# Altium schematic sheet JS7688_convert_board_v1.0.SchDoc
size A4
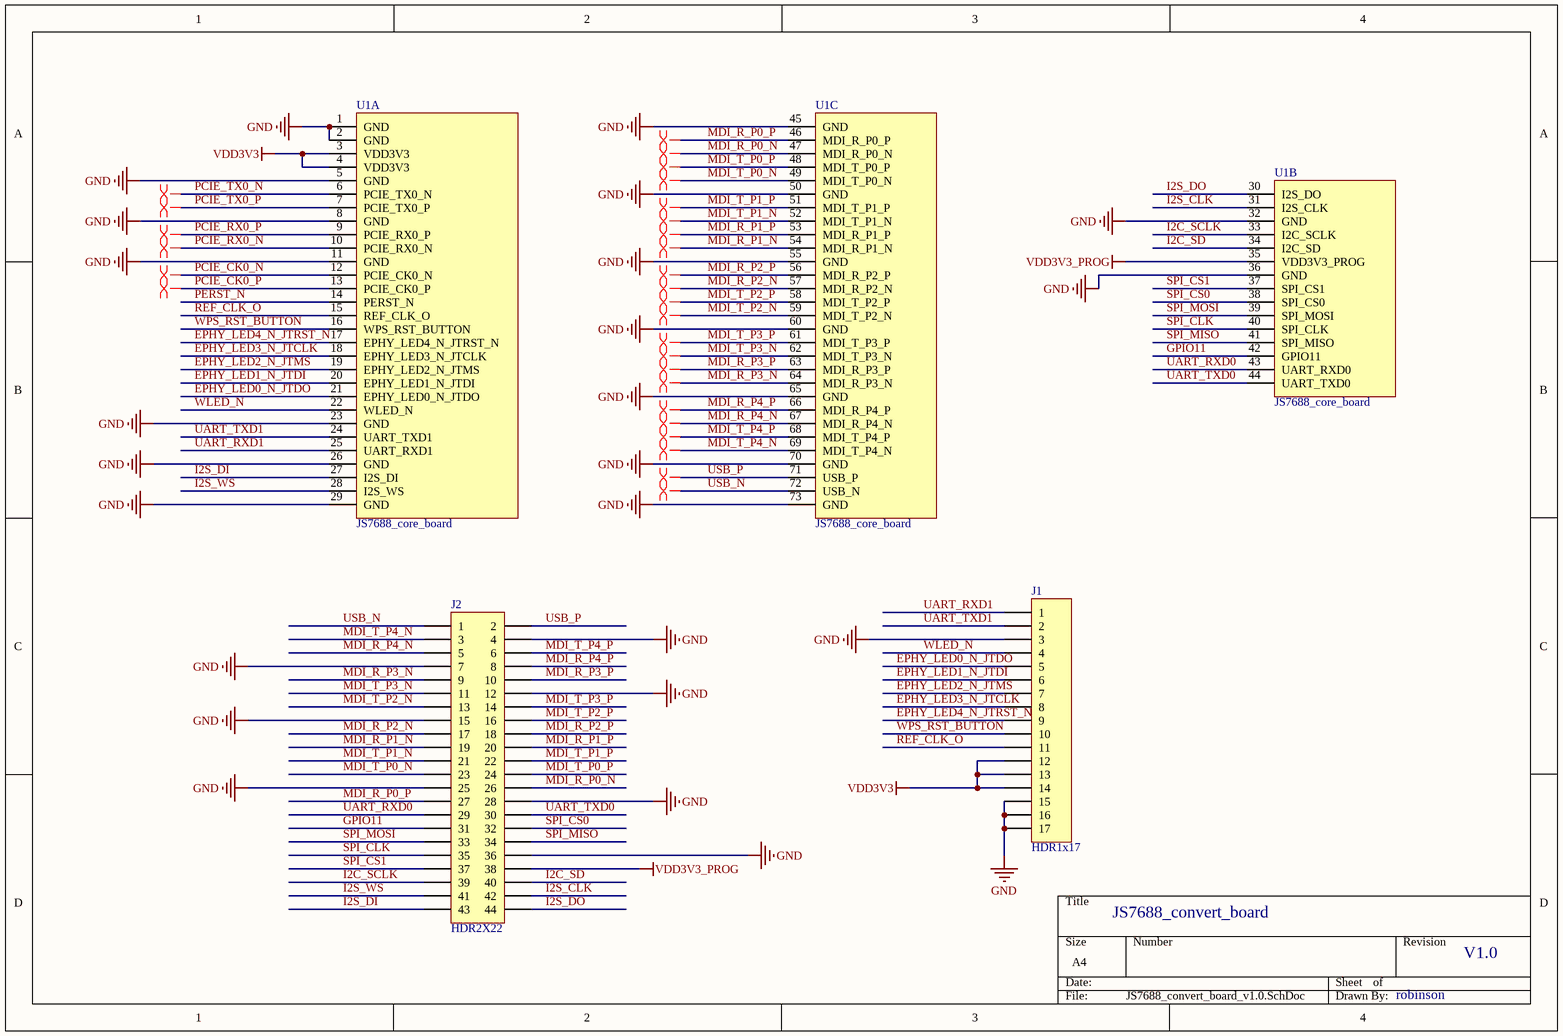
[diagram p0: JS7688_convert_board_v1.0.SchDoc]

## Parts
J1  HDR1x17  [HDR1x17-P-2.0mm]
J2  HDR2X22  [HDR2x22-P-2.0mm]
U1  JS7688_core_board  [JS7688_core_board]  (parts A,B,C of 3)

## Nets
GND: J1.3 J1.15 J1.16 J1.17 J2.4 J2.7 J2.12 J2.15 J2.25 J2.28 J2.36 U1.1(GND) U1.2(GND) U1.5(GND) U1.8(GND) U1.11(GND) U1.23(GND) U1.26(GND) U1.29(GND) U1.32(GND) U1.36(GND) U1.45(GND) U1.50(GND) U1.55(GND) U1.60(GND) U1.65(GND) U1.70(GND) U1.73(GND)
VDD3V3: J1.12 J1.13 J1.14 U1.3(VDD3V3) U1.4(VDD3V3)
VDD3V3_PROG: J2.38 U1.35(VDD3V3_PROG)
EPHY_LED0_N_JTDO: J1.5 U1.21(EPHY_LED0_N_JTDO)
EPHY_LED1_N_JTDI: J1.6 U1.20(EPHY_LED1_N_JTDI)
EPHY_LED2_N_JTMS: J1.7 U1.19(EPHY_LED2_N_JTMS)
EPHY_LED3_N_JTCLK: J1.8 U1.18(EPHY_LED3_N_JTCLK)
EPHY_LED4_N_JTRST_N: J1.9 U1.17(EPHY_LED4_N_JTRST_N)
GPIO11: J2.31 U1.42(GPIO11)
I2C_SCLK: J2.39 U1.33(I2C_SCLK)
I2C_SD: J2.40 U1.34(I2C_SD)
I2S_CLK: J2.42 U1.31(I2S_CLK)
I2S_DI: J2.43 U1.27(I2S_DI)
I2S_DO: J2.44 U1.30(I2S_DO)
I2S_WS: J2.41 U1.28(I2S_WS)
MDI_R_P0_N: J2.26 U1.47(MDI_R_P0_N)
MDI_R_P0_P: J2.27 U1.46(MDI_R_P0_P)
MDI_R_P1_N: J2.19 U1.54(MDI_R_P1_N)
MDI_R_P1_P: J2.20 U1.53(MDI_R_P1_P)
MDI_R_P2_N: J2.17 U1.57(MDI_R_P2_N)
MDI_R_P2_P: J2.18 U1.56(MDI_R_P2_P)
MDI_R_P3_N: J2.9 U1.64(MDI_R_P3_N)
MDI_R_P3_P: J2.10 U1.63(MDI_R_P3_P)
MDI_R_P4_N: J2.5 U1.67(MDI_R_P4_N)
MDI_R_P4_P: J2.8 U1.66(MDI_R_P4_P)
MDI_T_P0_N: J2.23 U1.49(MDI_T_P0_N)
MDI_T_P0_P: J2.24 U1.48(MDI_T_P0_P)
MDI_T_P1_N: J2.21 U1.52(MDI_T_P1_N)
MDI_T_P1_P: J2.22 U1.51(MDI_T_P1_P)
MDI_T_P2_N: J2.13 U1.59(MDI_T_P2_N)
MDI_T_P2_P: J2.16 U1.58(MDI_T_P2_P)
MDI_T_P3_N: J2.11 U1.62(MDI_T_P3_N)
MDI_T_P3_P: J2.14 U1.61(MDI_T_P3_P)
MDI_T_P4_N: J2.3 U1.69(MDI_T_P4_N)
MDI_T_P4_P: J2.6 U1.68(MDI_T_P4_P)
PCIE_CK0_N: U1.12(PCIE_CK0_N)
PCIE_CK0_P: U1.13(PCIE_CK0_P)
PCIE_RX0_N: U1.10(PCIE_RX0_N)
PCIE_RX0_P: U1.9(PCIE_RX0_P)
PCIE_TX0_N: U1.6(PCIE_TX0_N)
PCIE_TX0_P: U1.7(PCIE_TX0_P)
PERST_N: U1.14(PERST_N)
REF_CLK_O: J1.11 U1.15(REF_CLK_O)
SPI_CLK: J2.35 U1.40(SPI_CLK)
SPI_CS0: J2.32 U1.38(SPI_CS0)
SPI_CS1: J2.37 U1.37(SPI_CS1)
SPI_MISO: J2.34 U1.41(SPI_MISO)
SPI_MOSI: J2.33 U1.39(SPI_MOSI)
UART_RXD0: J2.29 U1.43(UART_RXD0)
UART_RXD1: J1.1 U1.25(UART_RXD1)
UART_TXD0: J2.30 U1.44(UART_TXD0)
UART_TXD1: J1.2 U1.24(UART_TXD1)
USB_N: J2.1 U1.72(USB_N)
USB_P: J2.2 U1.71(USB_P)
WLED_N: J1.4 U1.22(WLED_N)
WPS_RST_BUTTON: J1.10 U1.16(WPS_RST_BUTTON)

## Layout directives
differential pair: MDI_R_P0_N, MDI_R_P0_P, MDI_R_P1_N, MDI_R_P1_P, MDI_R_P2_N, MDI_R_P2_P, MDI_R_P3_N, MDI_R_P3_P, MDI_R_P4_N, MDI_R_P4_P, MDI_T_P0_N, MDI_T_P0_P, MDI_T_P1_N, MDI_T_P1_P, MDI_T_P2_N, MDI_T_P2_P, MDI_T_P3_N, MDI_T_P3_P, MDI_T_P4_N, MDI_T_P4_P, PCIE_CK0_N, PCIE_CK0_P, PCIE_RX0_N, PCIE_RX0_P, PCIE_TX0_N, PCIE_TX0_P, USB_N, USB_P

## Notes on the sheet
- JS7688_convert_board
- V1.0
- robinson